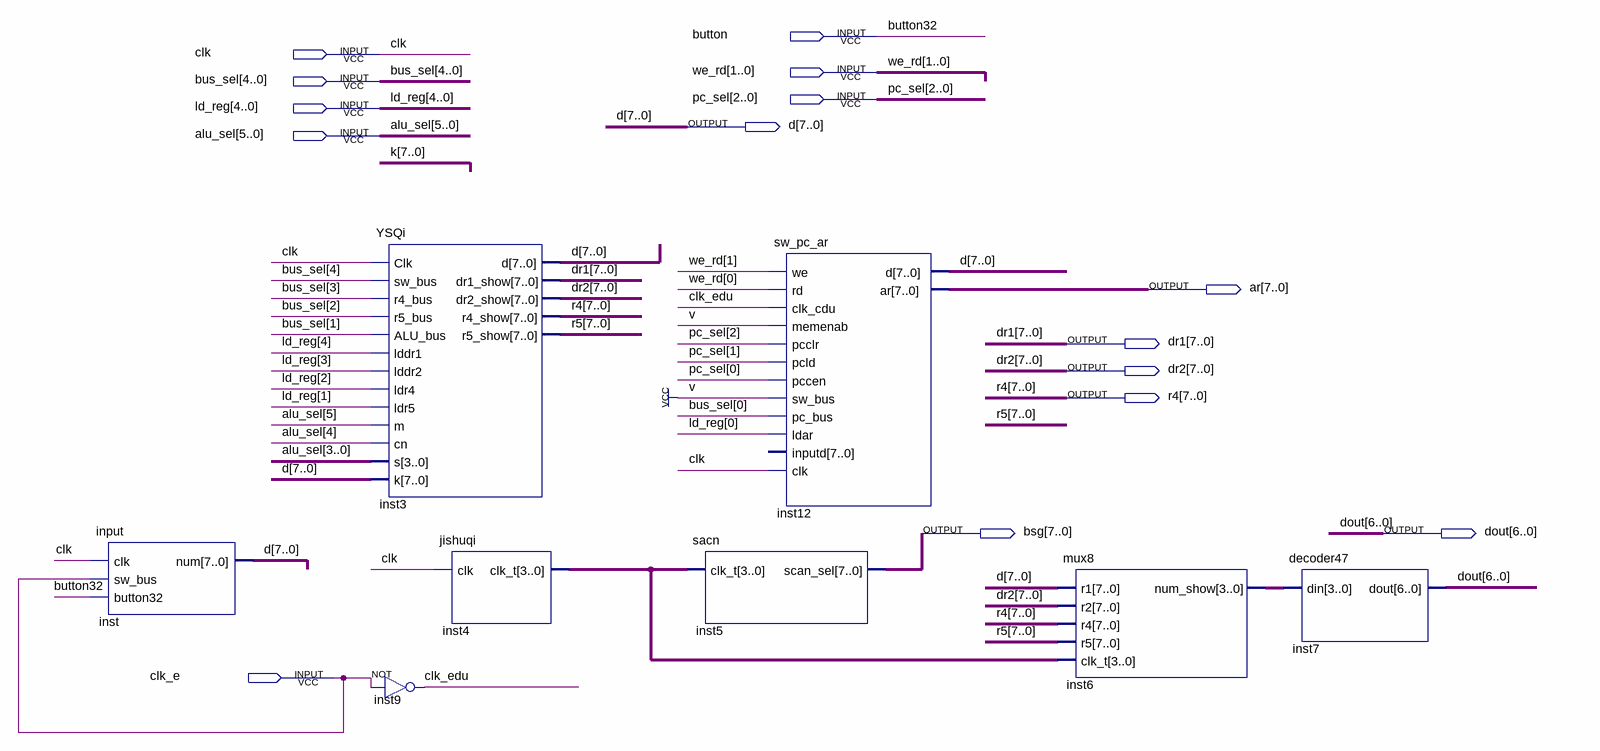
[diagram p0: schematic sheet]
// Quartus schematic data_bus.bdf as structural Verilog: 8 symbols, 15 pins
module data_bus (
  input  button,
  input  clk,
  input  [1:0] we_rd,
  input  [4:0] bus_sel,
  input  [2:0] pc_sel,
  input  [4:0] ld_reg,
  input  [5:0] alu_sel,
  input  clk_e,
  output [7:0] d,
  output [7:0] ar,
  output [7:0] dr1,
  output [7:0] dr2,
  output [7:0] r4,
  output [7:0] bsg,
  output [6:0] dout
);

  wire clk_edu;
  wire [3:0] inst4_clk_t, inst6_num_show;
  wire [7:0] r5;

  \input  inst (.clk(clk), .sw_bus(clk_e), .button32(button), .num(d));
  YSQi inst3 (
    .Clk(clk), .sw_bus(bus_sel[4]), .r4_bus(bus_sel[3]), .r5_bus(bus_sel[2]), .ALU_bus(bus_sel[1]),
    .lddr1(ld_reg[4]), .lddr2(ld_reg[3]), .ldr4(ld_reg[2]), .ldr5(ld_reg[1]), .m(alu_sel[5]),
    .cn(alu_sel[4]), .s(alu_sel[3:0]), .k(d), .dr1_show(dr1), .dr2_show(dr2), .r4_show(r4), .r5_show(r5),
    .d(d));
  not inst9 (clk_edu, clk_e);
  jishuqi inst4 (.clk(clk), .clk_t(inst4_clk_t));
  sacn inst5 (.clk_t(inst4_clk_t), .scan_sel(bsg));
  sw_pc_ar inst12 (
    .we(we_rd[1]), .rd(we_rd[0]), .clk_cdu(clk_edu), .memenab(1'b1), .pcclr(pc_sel[2]), .pcld(pc_sel[1]),
    .pccen(pc_sel[0]), .sw_bus(1'b1), .pc_bus(bus_sel[0]), .ldar(ld_reg[0]), .clk(clk), .ar(ar), .d(d));  // open: inputd
  mux8 inst6 (.r1(d), .r2(dr2), .r4(r4), .r5(r5), .clk_t(inst4_clk_t), .num_show(inst6_num_show));
  decoder47 inst7 (.din(inst6_num_show), .dout(dout));

  // Other names for the same wires on the sheet: button32 = button
endmodule
